# EAGLE design esp32md1 (EAGLE 9.6.2)
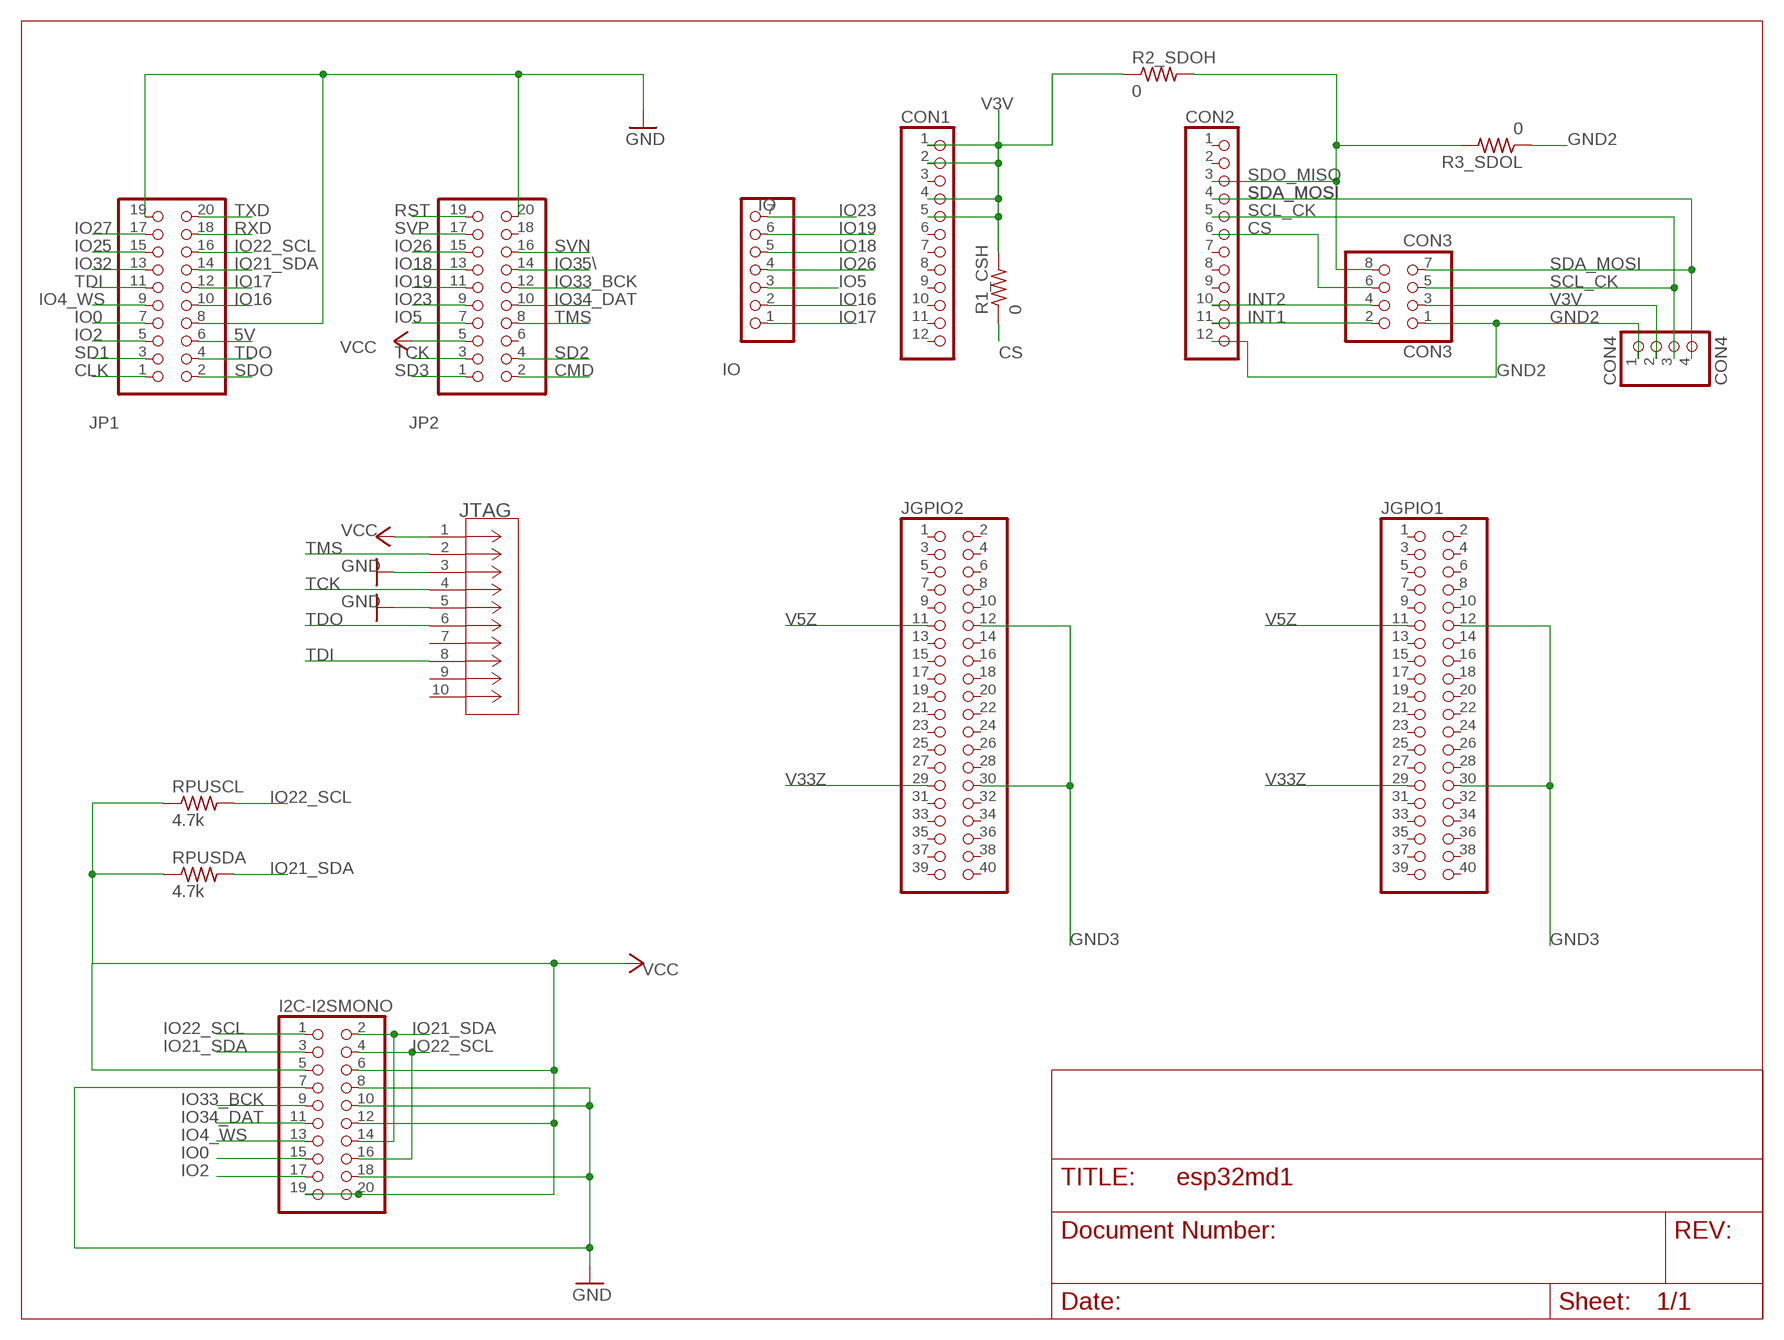
[diagram p0: schematic, sheet 1]

## Parts
CON1  PINHD-1X12  [1X12]
CON2  PINHD-1X12  [1X12]
CON3  CON3  PINHD-2X4  [2X04]
CON4  CON4  PINHD-1X4  [1X04]
I2C-I2SMONO  PINHD-2X10  [2X10]
IO  IO  PINHD-1X7  [1X07]
JGPIO1  PINHD-2X20  [2X20]
JGPIO2  PINHD-2X20  [2X20]
JP1  PINHD-2X10  [2X10]
JP2  PINHD-2X10  [2X10]
JTAG  M50-3600542CONN_M50-3600542_HRW-L  [CONN_M50-3600542_HRW-L]
R1_CSH  0  R-US_R0402  [R0402]
R2_SDOH  0  R-US_R0402  [R0402]
R3_SDOL  0  R-US_R0402  [R0402]
RPUSCL  4.7k  R-US_R0402  [R0402]
RPUSDA  4.7k  R-US_R0402  [R0402]

## Nets
5V: JP1.6
CLK: JP1.1
CMD: JP2.2
CS: CON2.6 CON3.6 R1_CSH.1
GND: I2C-I2SMONO.7 I2C-I2SMONO.8 I2C-I2SMONO.10 I2C-I2SMONO.18 JP1.8 JP1.19 JP2.20 JTAG.3 JTAG.5
GND2: CON2.12 CON3.1 CON4.1 R3_SDOL.1
GND3: JGPIO1.12 JGPIO1.30 JGPIO2.12 JGPIO2.30
INT1: CON2.11 CON3.2
INT2: CON2.10 CON3.4
IO0: I2C-I2SMONO.15 JP1.7
IO2: I2C-I2SMONO.17 JP1.5
IO4_WS: I2C-I2SMONO.13 JP1.9
IO5: IO.3 JP2.7
IO16: IO.2 JP1.10
IO17: IO.1 JP1.12
IO18: IO.5 JP2.13
IO19: IO.6 JP2.11
IO21_SDA: I2C-I2SMONO.2 I2C-I2SMONO.3 I2C-I2SMONO.14 JP1.14 RPUSDA.2
IO22_SCL: I2C-I2SMONO.1 I2C-I2SMONO.4 I2C-I2SMONO.16 JP1.16 RPUSCL.2
IO23: IO.7 JP2.9
IO25: JP1.15
IO26: IO.4 JP2.15
IO27: JP1.17
IO32: JP1.13
IO33_BCK: I2C-I2SMONO.9 JP2.12
IO34_DAT: I2C-I2SMONO.11 JP2.10
IO35\: JP2.14
RST: JP2.19
RXD: JP1.18
SCL_CK: CON2.5 CON3.5 CON4.3
SD1: JP1.3
SD2: JP2.4
SD3: JP2.1
SDA_MOSI: CON2.4 CON3.7 CON4.4
SDO: JP1.2
SDO_MISO: CON2.3 CON3.8 R2_SDOH.2 R3_SDOL.2
SVN: JP2.16
SVP: JP2.17
TCK: JP2.3 JTAG.4
TDI: JP1.11 JTAG.8
TDO: JP1.4 JTAG.6
TMS: JP2.8 JTAG.2
TXD: JP1.20
V3V: CON1.1 CON1.2 CON1.4 CON1.5 CON3.3 CON4.2 R1_CSH.2 R2_SDOH.1
V5Z: JGPIO1.11 JGPIO2.11
V33Z: JGPIO1.29 JGPIO2.29
VCC: I2C-I2SMONO.5 I2C-I2SMONO.6 I2C-I2SMONO.12 I2C-I2SMONO.19 I2C-I2SMONO.20 JP2.5 JTAG.1 RPUSCL.1 RPUSDA.1
Unconnected: CON1.3 CON1.6 CON1.7 CON1.8 CON1.9 CON1.10 CON1.11 CON1.12 CON2.1 CON2.2 CON2.7 CON2.8 CON2.9 JGPIO1.1 JGPIO1.2 JGPIO1.3 JGPIO1.4 JGPIO1.5 JGPIO1.6 JGPIO1.7 JGPIO1.8 JGPIO1.9 JGPIO1.10 JGPIO1.13 JGPIO1.14 JGPIO1.15 JGPIO1.16 JGPIO1.17 JGPIO1.18 JGPIO1.19 JGPIO1.20 JGPIO1.21 JGPIO1.22 JGPIO1.23 JGPIO1.24 JGPIO1.25 JGPIO1.26 JGPIO1.27 JGPIO1.28 JGPIO1.31 JGPIO1.32 JGPIO1.33 JGPIO1.34 JGPIO1.35 JGPIO1.36 JGPIO1.37 JGPIO1.38 JGPIO1.39 JGPIO1.40 JGPIO2.1 JGPIO2.2 JGPIO2.3 JGPIO2.4 JGPIO2.5 JGPIO2.6 JGPIO2.7 JGPIO2.8 JGPIO2.9 JGPIO2.10 JGPIO2.13 JGPIO2.14 JGPIO2.15 JGPIO2.16 JGPIO2.17 JGPIO2.18 JGPIO2.19 JGPIO2.20 JGPIO2.21 JGPIO2.22 JGPIO2.23 JGPIO2.24 JGPIO2.25 JGPIO2.26 JGPIO2.27 JGPIO2.28 JGPIO2.31 JGPIO2.32 JGPIO2.33 JGPIO2.34 JGPIO2.35 JGPIO2.36 JGPIO2.37 JGPIO2.38 JGPIO2.39 JGPIO2.40 JP2.6 JP2.18 JTAG.7 JTAG.9 JTAG.10

## Library data of the parts
CON1 CON2 = pinhead2:PINHD-1X12: PIN HEADER
CON3 = pinhead2:PINHD-2X4: PIN HEADER
CON4 = pinhead2:PINHD-1X4: PIN HEADER
I2C-I2SMONO JP1 JP2 = pinhead2:PINHD-2X10: PIN HEADER
IO = pinhead2:PINHD-1X7: PIN HEADER
JGPIO1 JGPIO2 = pinhead2:PINHD-2X20: PIN HEADER
JTAG = minijtag:M50-3600542; COPYRIGHT: Copyright (C) 2023 Ultra Librarian. All rights reserved.; MANUFACTURER_PART_NUMBER: M50-3600542; MFR_NAME: Harwin
R1_CSH R2_SDOH R3_SDOL RPUSCL RPUSDA = rcl:R-US_: RESISTOR, American symbol; SPICEPREFIX: R

## Board
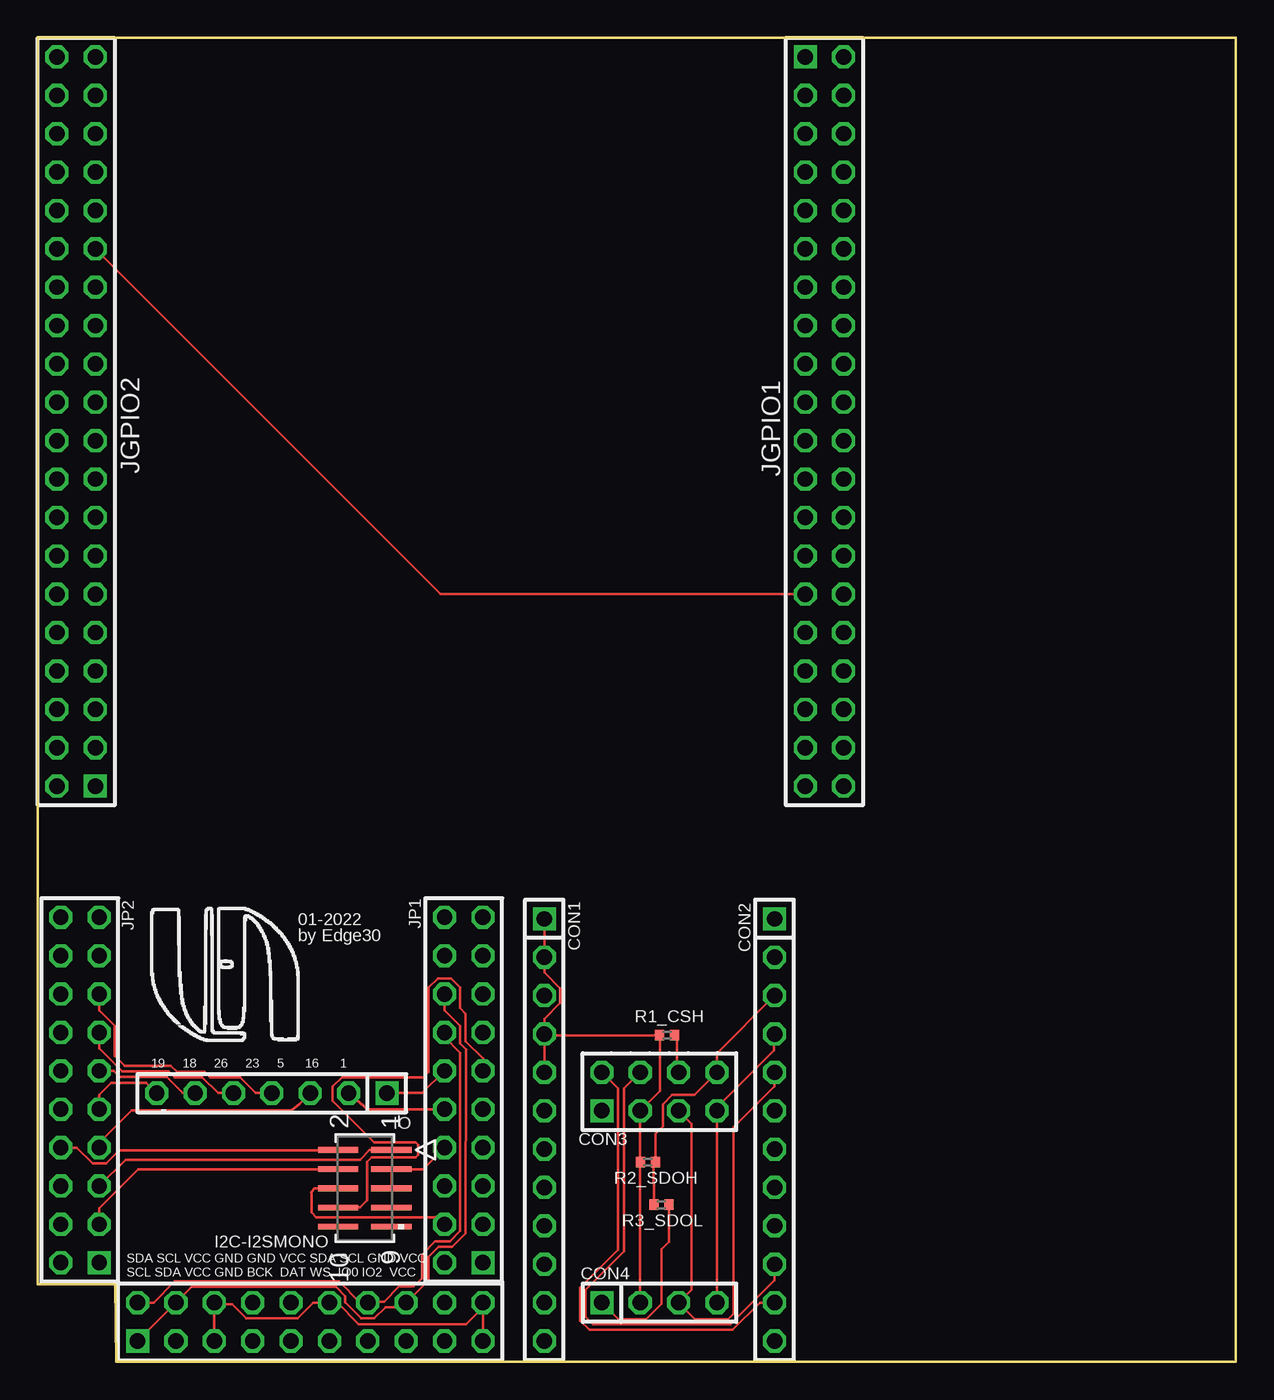
[diagram p1: board, top side]
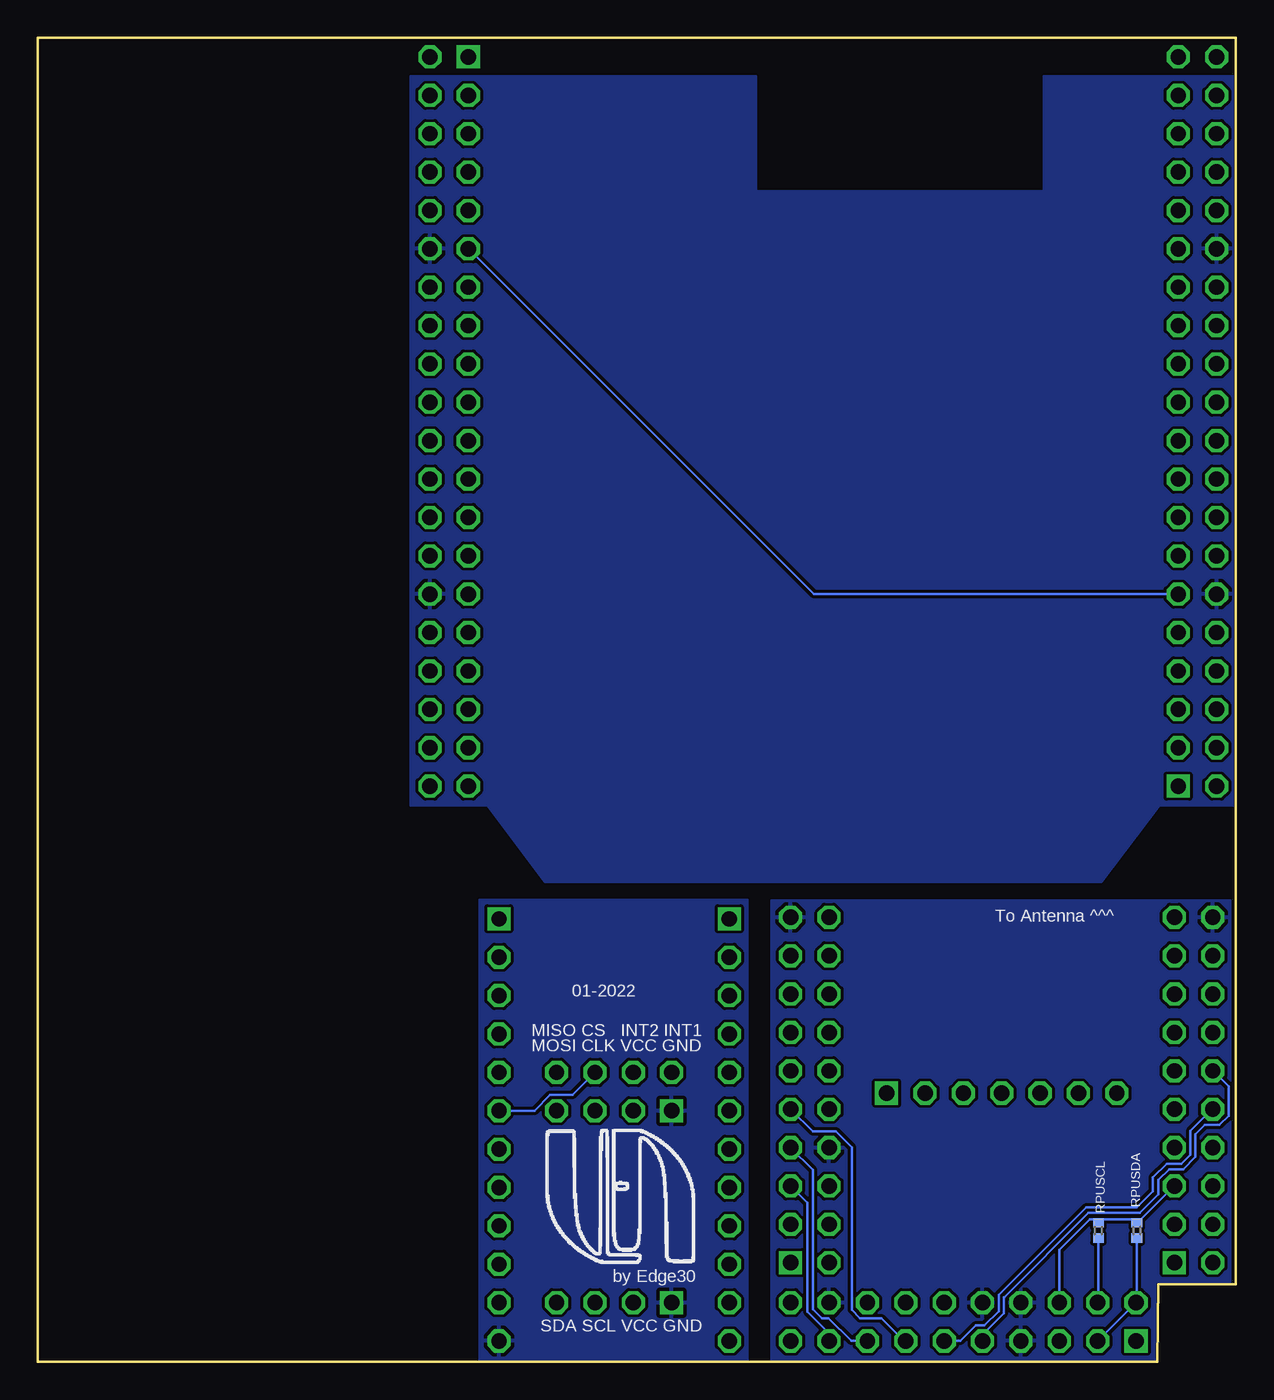
[diagram p2: board, bottom side, seen from below]

Size 79.3 x 87.63 mm. Coordinates in mm from the lower left corner, seen from the top.
Outline: 5.18,0 5.13,5.13 0,5.13 0,87.63 79.3,87.63 79.3,0 5.18,0
Copper layers (1*16): Top 0.035mm / dielectric 0.15mm / Bottom 0.035mm
Design rules "default *": minimum track width 6mil, minimum drill 0.35mm, track to track 8mil, track to pad 8mil, pad to pad 8mil, via to via 8mil, smd to smd 6mil, copper to edge 1mil, drill to drill 6mil, minimum pad ring 10mil, minimum via ring 8mil, stop-mask expansion 4mil, vias tented up to drill 0mil, thermal gap 10mil

### Footprints (pad centres in the part's own frame; a part is rotated, then mirrored left to right if it is on the bottom)
1X12 = drill 1.016 square: 1 -13.97,0 | drill 1.016 octagon: 2 -11.43,0; 3 -8.89,0; 4 -6.35,0; 5 -3.81,0; 6 -1.27,0; 7 1.27,0; 8 3.81,0; 9 6.35,0; 10 8.89,0; 11 11.43,0; 12 13.97,0
2X04 = drill 1.016 square: 1 -3.81,-1.27 | drill 1.016 octagon: 2 -3.81,1.27; 3 -1.27,-1.27; 4 -1.27,1.27; 5 1.27,-1.27; 6 1.27,1.27; 7 3.81,-1.27; 8 3.81,1.27
1X04 = drill 1.016 square: 1 -3.81,0 | drill 1.016 octagon: 2 -1.27,0; 3 1.27,0; 4 3.81,0
2X10 = drill 1.016 square: 1 -11.43,-1.27 | drill 1.016 octagon: 2 -11.43,1.27; 3 -8.89,-1.27; 4 -8.89,1.27; 5 -6.35,-1.27; 6 -6.35,1.27; 7 -3.81,-1.27; 8 -3.81,1.27; 9 -1.27,-1.27; 10 -1.27,1.27; 11 1.27,-1.27; 12 1.27,1.27; 13 3.81,-1.27; 14 3.81,1.27; 15 6.35,-1.27; 16 6.35,1.27; 17 8.89,-1.27; 18 8.89,1.27; 19 11.43,-1.27; 20 11.43,1.27
1X07 = drill 1.016 square: 1 -7.62,0 | drill 1.016 octagon: 2 -5.08,0; 3 -2.54,0; 4 0,0; 5 2.54,0; 6 5.08,0; 7 7.62,0
2X20 = drill 1.016 square: 1 -24.13,-1.27 | drill 1.016 octagon: 2 -24.13,1.27; 3 -21.59,-1.27; 4 -21.59,1.27; 5 -19.05,-1.27; 6 -19.05,1.27; 7 -16.51,-1.27; 8 -16.51,1.27; 9 -13.97,-1.27; 10 -13.97,1.27; 11 -11.43,-1.27; 12 -11.43,1.27; 13 -8.89,-1.27; 14 -8.89,1.27; 15 -6.35,-1.27; 16 -6.35,1.27; 17 -3.81,-1.27; 18 -3.81,1.27; 19 -1.27,-1.27; 20 -1.27,1.27; 21 1.27,-1.27; 22 1.27,1.27; 23 3.81,-1.27; 24 3.81,1.27; 25 6.35,-1.27; 26 6.35,1.27; 27 8.89,-1.27; 28 8.89,1.27; 29 11.43,-1.27; 30 11.43,1.27; 31 13.97,-1.27; 32 13.97,1.27; 33 16.51,-1.27; 34 16.51,1.27; 35 19.05,-1.27; 36 19.05,1.27; 37 21.59,-1.27; 38 21.59,1.27; 39 24.13,-1.27; 40 24.13,1.27
CONN_M50-3600542_HRW-L = smd 0.381 x 2.667: 1 2.54,-1.765; 2 2.54,1.765; 3 1.27,-1.765; 4 1.27,1.765; 5 0,-1.765; 6 0,1.765; 7 -1.27,-1.765; 8 -1.27,1.765; 9 -2.54,-1.765; 10 -2.54,1.765
R0402 = smd 0.6 x 0.7: 1 -0.5,0; 2 0.5,0

### Placement (x,y rotation side)
CON1  33.53,15.34 270 top
CON2  48.77,15.34 270 top
CON3  41.15,17.88 0 top
CON4  41.15,3.91 0 top
I2C-I2SMONO  18.03,2.64 0 top
IO  15.49,17.78 180 top
JGPIO1  52.07,62.23 270 top
JGPIO2  2.54,62.23 90 top
JP1  28.19,17.98 90 top
JP2  2.79,17.98 90 top
JTAG  21.64,11.48 90 top
R1_CSH  41.66,21.62 180 top
R2_SDOH  40.39,13.21 0 top
R3_SDOL  41.27,10.39 180 top
RPUSCL  9.09,8.69 270 bottom
RPUSDA  6.55,8.69 270 bottom

### Tracks (layer width: path | path; a pad name or v marks a point on that pad's centre or on a via)
CS
  Top 0.152: CON3.6 42.32,19.25 42.32,21.45 R1_CSH.1
  Bottom 0.152: CON2.6 46.43,16.61 45.39,17.65 43.92,17.65 CON3.6
GND
  Top 0.152: JP1.8 25.5,12.75 JTAG.3 | JTAG.3 | JTAG.5 23.41,12.74 JTAG.3
  pour Bottom: 0.36,30.53 30.73,30.53 30.73,0.1 5.33,0.1 5.33,5.28 0.36,5.28
GND2
  Top 0.152: R3_SDOL.1 41.77,7.95 41.27,7.45 41.27,3.84 40.26,2.82 38.43,2.82 CON4.1
  pour Bottom: 32.31,30.58 50.06,30.58 50.06,0.1 32.31,0.1
GND3
  pour Bottom: 0,85.09 12.7,85.09 12.7,77.47 31.75,77.47 31.75,85.09 54.61,85.09 54.61,36.83 49.53,36.83 45.72,31.75 8.89,31.75 5.08,36.83 0,36.83
INT1
  Top 0.152: CON3.2 38.41,18.09 38.41,7.42 35.89,4.9 35.89,2.72 36.51,2.11 45.99,2.11 47.8,3.91 CON2.11
INT2
  Top 0.152: CON3.4 38.81,18.09 38.81,7.32 36.25,4.75 36.25,2.97 36.75,2.46 45.85,2.46 48.77,5.38 CON2.10
IO0
  Bottom 0.152: I2C-I2SMONO.15 25.45,1.37 26.95,2.87 27.4,2.87 27.99,3.46 27.99,12.7 JP1.7
IO2
  Bottom 0.152: JP1.5 28.35,10.52 28.35,3.31 26.92,1.89 I2C-I2SMONO.17
IO4_WS
  Bottom 0.152: JP1.9 27.99,15.24 26.47,15.24 25.43,14.2 25.43,3.43 24.87,2.87 23.45,2.87 22,1.42 21.89,1.42 I2C-I2SMONO.13
IO5
  Top 0.152: JP2.7 4.06,14.48 6.22,16.64 16.79,16.64 17.32,17.06 IO.3
IO16
  Top 0.152: JP1.10 21.84,16.71 IO.2
IO17
  Top 0.152: IO.1 25.45,17.78 JP1.12
IO18
  Top 0.152: JP2.13 4.06,20.73 5.59,19.2 8.68,19.2 9.06,18.82 10.9,18.82 11.94,17.78 IO.5
IO19
  Top 0.152: JP2.11 5.03,19.25 5.44,18.85 8.53,18.85 9.6,17.78 IO.6
IO21_SDA
  Top 0.152: JP1.14 26.92,21.49 27.96,20.45 27.96,8.66 27.28,7.98 26.31,7.98 25.43,7.09 25.43,5.51 24.89,4.98 23.93,4.98 22.91,3.96 21.89,3.96 I2C-I2SMONO.14 21.33,3.91 19.93,5.31 9.07,5.31 7.67,3.91 I2C-I2SMONO.2
  Bottom 0.152: RPUSDA.2 6.55,3.96 I2C-I2SMONO.2 I2C-I2SMONO.3
IO22_SCL
  Top 0.152: I2C-I2SMONO.4 9.14,3.86 9.09,3.86 I2C-I2SMONO.1 | I2C-I2SMONO.4 | I2C-I2SMONO.4 10.19,4.95 19.73,4.95 20.34,4.34 20.34,3.94 21.41,2.87 22.27,2.87 23.01,3.61 24.08,3.61 I2C-I2SMONO.16 25.86,5.38 25.86,6.96 26.52,7.62 27.43,7.62 28.32,8.52 28.34,20.68 27.96,21.06 27.96,22.23 26.92,23.27 JP1.16
  Bottom 0.152: RPUSCL.2 9.09,3.96 I2C-I2SMONO.4 9.2,3.91
IO23
  Top 0.152: JP2.9 4.06,17.68 4.85,18.47 7.19,18.47 IO.7
IO26
  Top 0.152: JP2.15 4.06,23.27 5.11,22.23 5.11,20.24 5.77,19.58 8.81,19.58 9.22,19.18 11.04,19.18 11.4,18.82 13.39,18.82 14.43,17.78 | 14.43,17.78 | 14.43,17.78 IO.4
IO33_BCK
  Bottom 0.152: I2C-I2SMONO.9 16.76,1.78 15.34,3.21 15.34,4.27 9.75,9.86 6.35,9.86 5.13,11.07 5.13,12.04 4.42,12.75 3.46,12.75 2.67,13.55 2.67,15.06 2.06,15.67 1.09,15.67 0.48,16.28 0.48,18.21 JP2.12
IO34_DAT
  Bottom 0.152: JP2.10 1.57,16.71 3.02,15.27 3.02,13.7 3.61,13.11 4.57,13.11 5.49,12.19 5.49,11.28 6.55,10.21 9.91,10.21 15.7,4.42 15.7,3.35 16.64,2.41 17.2,2.41 18.24,1.37 I2C-I2SMONO.11
SCL_CK
  Top 0.152: CON2.5 48.77,18.24 46.05,15.52 46.05,3.17 45.69,2.82 43.51,2.82 CON4.3 | CON4.3 | CON3.5 43.28,15.75 43.28,4.78 CON4.3
SDA_MOSI
  Top 0.152: CON2.4 48.72,21.69 48.72,20.6 44.96,16.84 CON3.7 CON4.4
SDO_MISO
  Top 0.152: R2_SDOH.2 40.89,13.26 | 40.89,13.26 40.89,15.08 41.38,15.57 41.38,17.04 41.99,17.65 43.46,17.65 CON3.8 44.96,20.42 CON2.3 | R3_SDOL.2 40.77,13.14 40.89,13.26
TCK
  Top 0.152: JP2.3 4.06,10.16 6.66,12.75 JTAG.4
TDI
  Top 0.152: JP1.11 29.46,20.07 28.32,21.21 28.32,23.03 27.94,23.41 27.94,23.88 27.96,23.9 27.96,24.77 27.36,25.38 26.49,25.38 25.88,24.77 25.88,19.18 25.53,18.82 20.14,18.82 19.53,18.21 19.53,17.25 22.27,14.52 25.01,14.52 25.17,14.35 25.17,13.69 25.01,13.53 22.08,13.53 21.79,13.23 21.79,10.67 21.34,10.21 JTAG.8
TDO
  Top 0.152: JP1.4 26.45,9.56 18.43,9.56 18.11,9.88 18.11,11.2 18.09,11.23 18.34,11.48 JTAG.6
TMS
  Top 0.152: JP2.8 2.59,14.17 3.63,13.13 4.55,13.13 5.4,13.98 19.84,13.98 JTAG.2
V3V
  Top 0.152: R1_CSH.2 41.12,21.65 | R1_CSH.2 41.19,21.65 41.19,17.92 CON3.3 39.88,13.2 | CON1.1 CON1.2 33.53,25.75 34.57,24.71 34.57,23.75 33.53,22.71 CON1.4 | CON1.4 CON1.5 | CON4.2 39.88,13.2 | 39.88,13.2 R2_SDOH.1 | CON1.4 33.6,21.61 R1_CSH.2
  Bottom 0.152: CON3.3 39.84,16.61
V5Z
  Bottom 0.152: JGPIO2.11 27.94,50.8 JGPIO1.11
V33Z
  Top 0.152: JGPIO2.29 26.67,50.8 JGPIO1.29
VCC
  Top 0.152: I2C-I2SMONO.6 11.68,3.81 | 11.68,3.81 I2C-I2SMONO.5 | I2C-I2SMONO.19 I2C-I2SMONO.20 29.46,3.61 28.35,2.49 21.23,2.49 19.84,3.89 19.86,3.91 I2C-I2SMONO.12 18.24,3.91 17.2,2.87 13.79,2.87 12.85,3.81 11.68,3.81 | JTAG.1 21.97,14.02 21.32,13.37 5.8,13.37 JP2.5
  Bottom 0.152: I2C-I2SMONO.6 | I2C-I2SMONO.6 11.68,7.41 9.65,9.44 9.35,9.44 RPUSCL.1 8.84,9.44 6.81,9.44 RPUSDA.1 6.51,9.19 JP2.5 4.17,11.63

### Text on the board
tPlace: 01-2022 | by Edge30 | 19 18 26 23 5 16 1 | SDA SCL VCC GND GND VCC SDA SCL GND VCC / SCL SDA VCC GND BCK DAT WS IO0 IO2 VCC
bPlace: To Antenna ^^^ | 01-2022 | by Edge30
bNames: MISO CS INT2 INT1 | MOSI CLK VCC GND | SDA SCL VCC GND